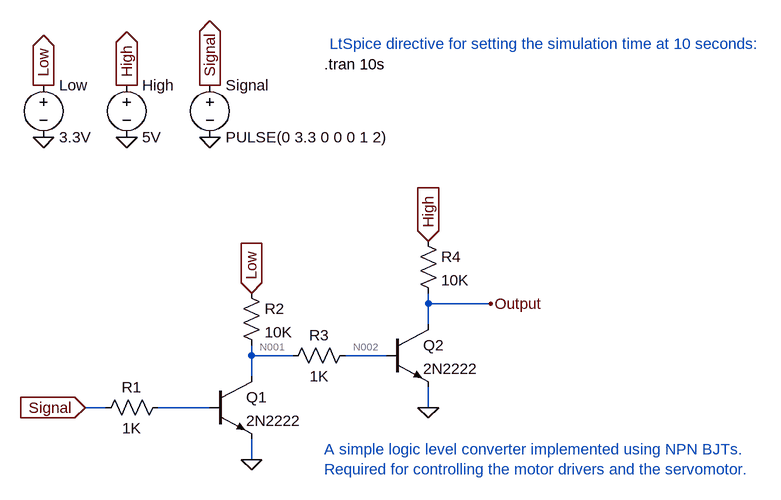
[diagram p0: schematic LogicLevelConverter.asc]
LogicLevelConverter.asc, the LTspice schematic file:
Version 4
SHEET 1 2224 680
WIRE 1104 -128 1104 -144
WIRE 1200 -128 1104 -128
WIRE 1104 -96 1104 -128
WIRE 832 -48 832 -64
WIRE 896 -48 832 -48
WIRE 1040 -48 976 -48
WIRE 832 -16 832 -48
WIRE 608 32 576 32
WIRE 768 32 688 32
WIRE 1104 32 1104 0
WIRE 832 112 832 80
FLAG 640 -384 0
FLAG 640 -464 High
IOPIN 640 -464 Out
FLAG 512 -384 0
FLAG 512 -464 Low
IOPIN 512 -464 Out
FLAG 768 -384 0
FLAG 768 -464 Signal
IOPIN 768 -464 Out
FLAG 576 32 Signal
IOPIN 576 32 In
FLAG 832 112 0
FLAG 832 -144 Low
IOPIN 832 -144 In
FLAG 1104 32 0
FLAG 1104 -224 High
IOPIN 1104 -224 In
FLAG 1200 -128 Output
SYMBOL voltage 640 -480 R0
SYMATTR InstName High
SYMATTR Value 5V
SYMBOL voltage 512 -480 R0
SYMATTR InstName Low
SYMATTR Value 3.3V
SYMBOL voltage 768 -480 R0
WINDOW 123 0 0 Left 0
WINDOW 39 0 0 Left 0
SYMATTR InstName Signal
SYMATTR Value PULSE(0 3.3 0 0 0 1 2)
SYMBOL res 704 16 R90
WINDOW 0 0 56 VBottom 2
WINDOW 3 32 56 VTop 2
SYMATTR InstName R1
SYMATTR Value 1K
SYMBOL npn 768 -16 R0
SYMATTR InstName Q1
SYMATTR Value 2N2222
SYMBOL res 816 -160 R0
SYMATTR InstName R2
SYMATTR Value 10K
SYMBOL res 992 -64 R90
WINDOW 0 0 56 VBottom 2
WINDOW 3 32 56 VTop 2
SYMATTR InstName R3
SYMATTR Value 1K
SYMBOL npn 1040 -96 R0
SYMATTR InstName Q2
SYMATTR Value 2N2222
SYMBOL res 1088 -240 R0
SYMATTR InstName R4
SYMATTR Value 10K
TEXT 944 -496 Left 2 !.tran 10s
TEXT 944 96 Left 2 ;A simple logic level converter implemented using NPN BJTs. \nRequired for controlling the motor drivers and the servomotor.
TEXT 952 -528 Left 2 ;LtSpice directive for setting the simulation time at 10 seconds:

The netlist it stands for:
* LogicLevelConverter.asc
V§High High 0 5V
V§Low Low 0 3.3V
V§Signal Signal 0 PULSE(0 3.3 0 0 0 1 2)
R1 N003 Signal 1K
Q1 N001 N003 0 0 2N2222
R2 Low N001 10K
R3 N002 N001 1K
Q2 Output N002 0 0 2N2222
R4 High Output 10K
.model NPN NPN
.model PNP PNP
.lib standard.bjt
.tran 10s
* A simple logic level converter implemented using NPN BJTs.
* Required for controlling the motor drivers and the servomotor.
* LtSpice directive for setting the simulation time at 10 seconds:
.backanno
.end

* Results of the author's LTspice run, read from the files saved beside the schematic
* Operating Point, zero values left out:
*   V(high) = 5 V
*   V(low) = 3.3 V
*   V(n001) = 906.4 mV
*   V(n002) = 667 mV
*   V(output) = 18.99 mV
*   Ic(Q2) = 498.1 µA
*   Ib(Q2) = 239.4 µA
*   Ie(Q2) = -737.5 µA
*   I(R4) = 498.1 µA
*   I(R3) = -239.4 µA
*   I(R2) = 239.4 µA
*   I(Low) = -239.4 µA
*   I(High) = -498.1 µA
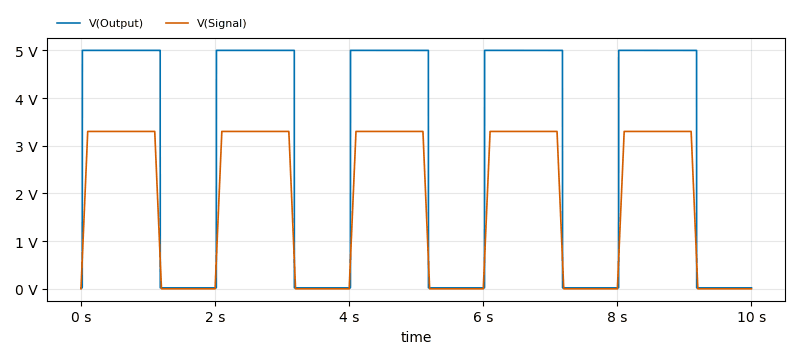
[diagram p1: Transient Analysis of LogicLevelConverter.asc, plotted from the saved traces]
* Transient Analysis, 1 run:
*   V(Output): min 18.99 mV, max 5 V, average 2.914 V, rms 3.812 V, last 18.99 mV
*   V(Signal): min 0 V, max 3.3 V, average 1.815 V, rms 2.41 V, last 0 V